# EAGLE board MGBC-MBL-01_1-5_2 (EAGLE 9.6.2)
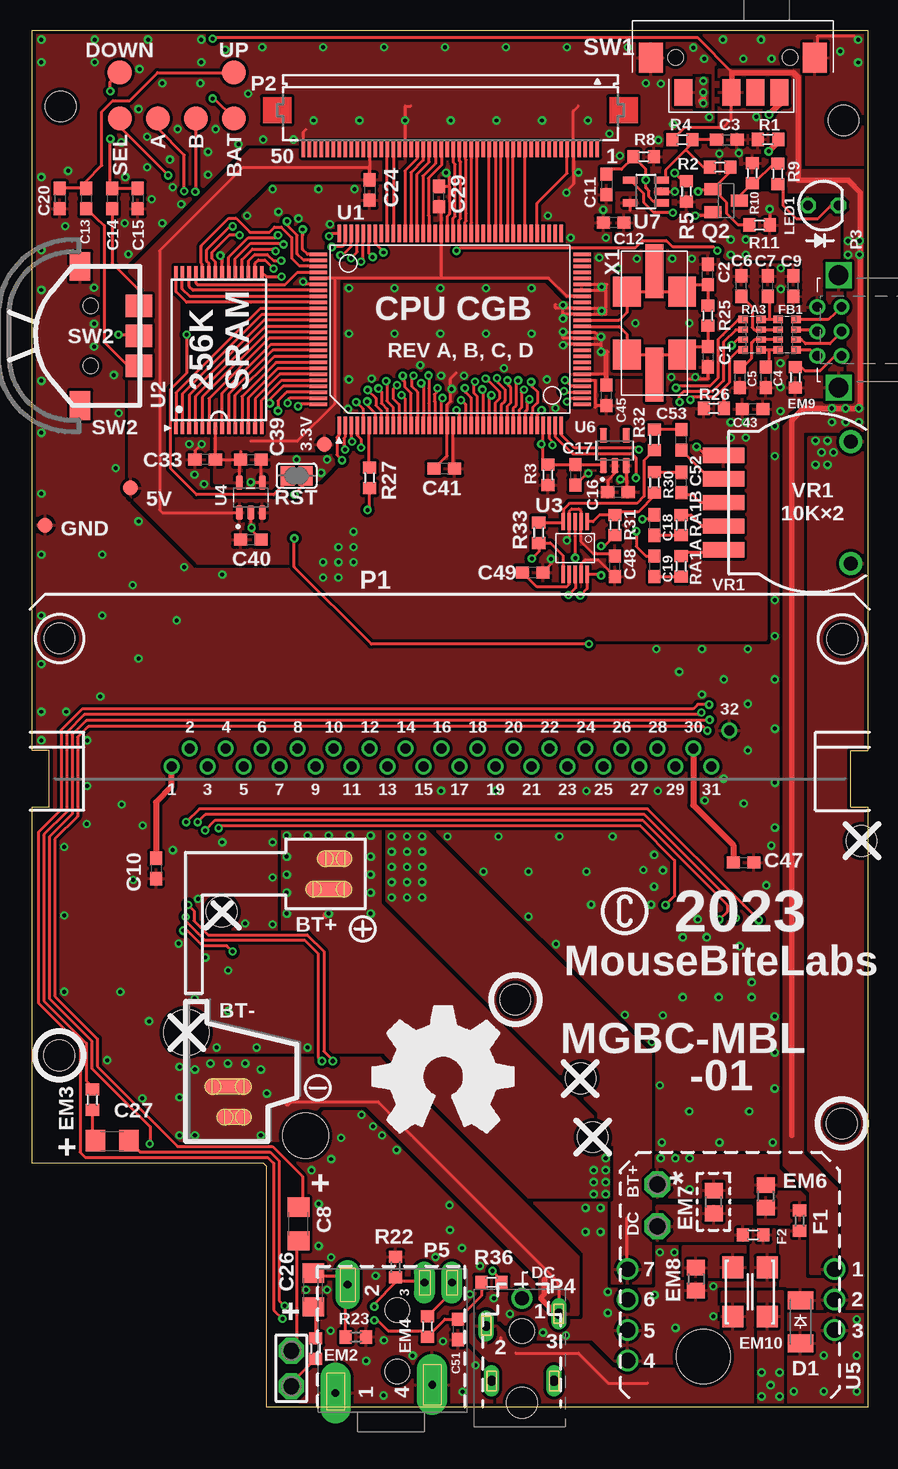
[diagram p1: board, top side]
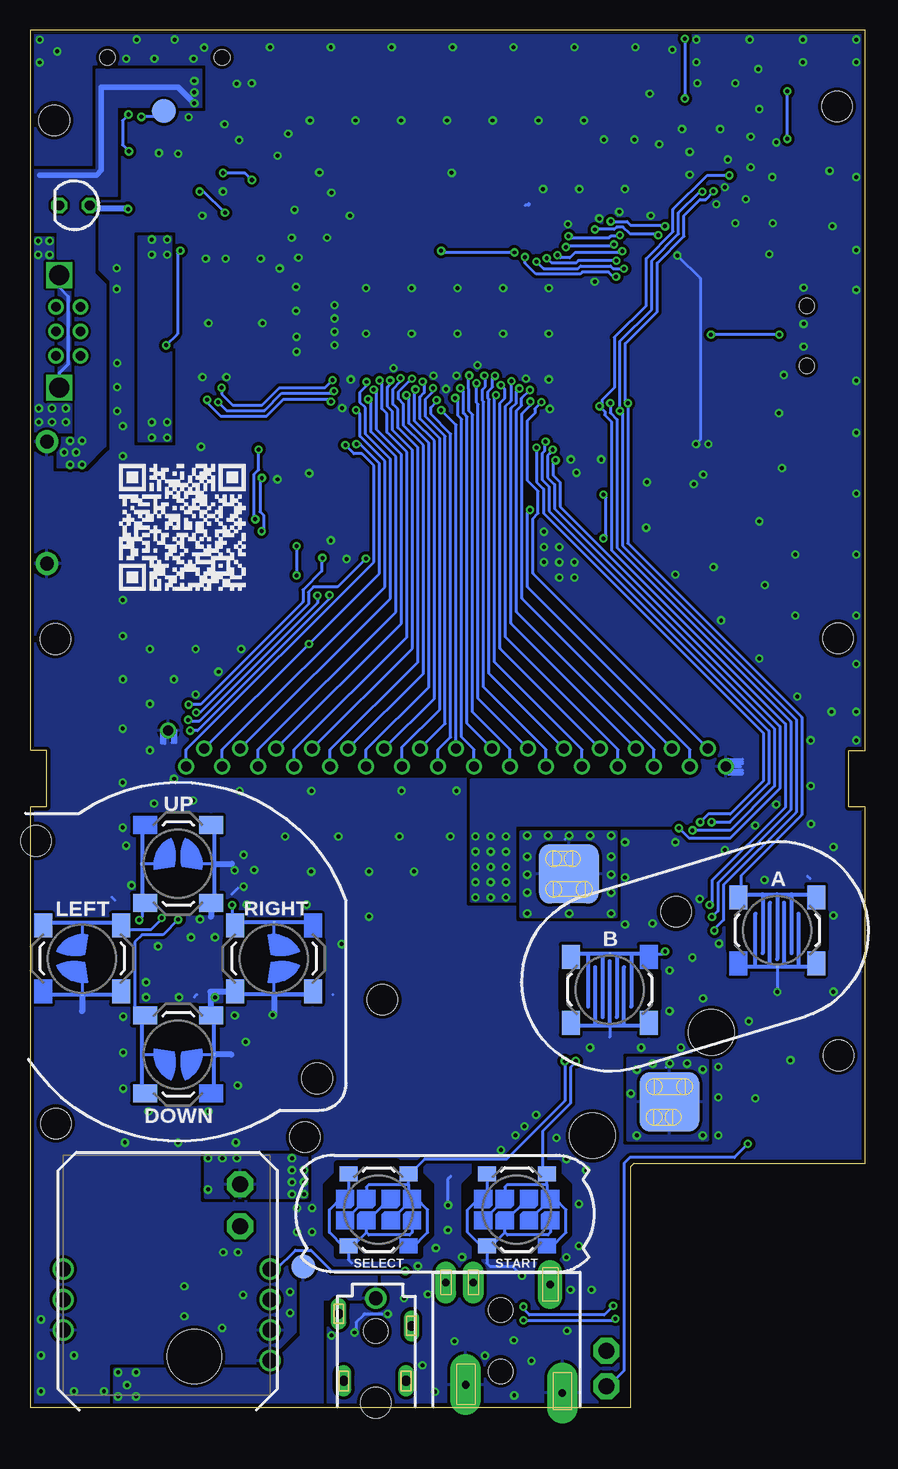
[diagram p2: board, bottom side, seen from below]

Size 69.66 x 114.8 mm. Coordinates in mm from the lower left corner, seen from the top.
Outline: 0,54.73 0,114.8 69.66,114.8 69.66,54.73 68.25,54.73 68.25,50.03 69.66,50.03 69.66,0 19.56,0 19.56,20.06 19.3,20.31 0,20.31 0,50.03 1.4,50.03 1.4,54.73 0,54.73
Copper layers (1*16): Top 0.0356mm / dielectric 1.5011mm / Bottom 0.0356mm
Design rules "jlcpcb *": minimum track width 10mil, minimum drill 13mil, track to track 8mil, track to pad 8mil, pad to pad 8mil, via to via 8mil, smd to smd 5mil, copper to edge 12mil, drill to drill 22mil, minimum pad ring 10mil, minimum via ring 7mil, stop-mask expansion 2.5mil, vias tented up to drill 14mil, thermal gap 10mil
Holes 2.54 mm at 2.37,108.43 67.63,107.27 2.28,64.08 67.54,64.03 2.25,29.33 67.5,23.64 40.28,33.97 45.72,27.4 46.74,22.5 15.8,41.29 69.15,47.19
Holes 3.81 mm at 12.85,31.23 22.78,22.63
Holes 4.5 mm at 55.95,4.22
tRestrict: area 64.1,99.6 to 65.2,100.4; area 24.6,-0.8 to 27.7,-0.1; area 58.9,102.1 to 59.5,103.1; area 45.5,88.8 to 46.2,91.6; area 22.5,14.3 to 23,16.2; area 23.8,-1.8 to 35.8,0
bRestrict: area 24.6,-0.8 to 27.7,-0.1; area 32.8,52.9 to 56.3,53.8; area 23.8,-1.8 to 35.8,0; area 3.7,42.8 to 4.1,43.2; area 17.5,31.2 to 18.3,32.2; area 45.5,33.8 to 46.4,34.9; area 53.7,48.3 to 54.8,49.2; area 45.4,33.8 to 45.6,35.8

## Footprints (pad centres in the part's own frame; a part is rotated, then mirrored left to right if it is on the bottom)
B1,27 = smd 1.27 x 1.27: TP 0,0
MGB+BATTERY4 = smd 4.953 x 4.953 bottom: P$1 0.5,0 | smd 2.959 x 1.397: P$2 0.997,1.27 | smd 3.937 x 1.397: P$3 0.514,-1.27
MGB-BATTERY4 = smd 4.953 x 4.953 bottom: P$1 0.25,0.117 | smd 2.959 x 1.397: P$3 0.743,-1.143 | smd 3.937 x 1.397: P$4 0.26,1.397
DMG_BTN3 = smd 1.5 x 2: P$1 -3.25,2.75; P$3 3.25,2.75; P$4 3.25,-2.75 | smd 0.25 x 0.25: P$2 0,-3
TP20R = smd 2 x 2: TP 0,0
P1-13 = drill 1.321 pad 2.159 octagon: TP 0,0
C0603 = smd 1.1 x 1: 1 -0.85,0; 2 0.85,0
C1206 = smd 1.6 x 1.8: 1 -1.4,0; 2 1.4,0
SOD-123_MINI-SMA = smd 1.5 x 2.1: A 1.8,0; C -1.8,0
MGB_BTN1_2 = smd 1.5 x 2: P$1 -3.25,2.75; P$3 3.25,2.75; P$4 3.25,-2.75 | smd 0.25 x 0.25: P$2 0,-3
R0603 = smd 1 x 1.1: 1 -0.85,0; 2 0.85,0
R0805 = smd 1.3 x 1.5: 1 -0.95,0; 2 0.95,0
ACM4532 = smd 1.8 x 1.75: 1 -2.05,1.425; 2 -2.05,-1.425; 3 2.05,-1.425; 4 2.05,1.425
EXB38V = smd 0.6 x 0.8: 1 -1.275,-0.75; 4 1.275,-0.75; 5 1.275,0.75; 8 -1.275,0.75 | smd 0.5 x 0.8: 2 -0.4,-0.75; 3 0.4,-0.75; 6 0.4,0.75; 7 -0.4,0.75
LED3MM = drill 0.813 octagon: A -1.27,0; K 1.27,0
MGB-CART = drill 0.83: 1 0,0; 2 1.5,1.5; 3 3,0; 4 4.5,1.5; 5 6,0; 6 7.5,1.5; 7 9,0; 8 10.5,1.5; 9 12,0; 10 13.5,1.5; 11 15,0; 12 16.5,1.5; 13 18,0; 14 19.5,1.5; 15 21,0; 16 22.5,1.5; 17 24,0; 18 25.5,1.5; 19 27,0; 20 28.5,1.5; 21 30,0; 22 31.5,1.5; 23 33,0; 24 34.5,1.5; 25 36,0; 26 37.5,1.5; 27 39,0; 28 40.5,1.5; 29 42,0; 30 43.5,1.5; 31 45,0; 32 46.5,3
FH12-50S-0.5SH = smd 0.3 x 1.3: 1 -12.25,3.25; 2 -11.75,3.25; 3 -11.25,3.25; 4 -10.75,3.25; 5 -10.25,3.25; 6 -9.75,3.25; 7 -9.25,3.25; 8 -8.75,3.25; 9 -8.25,3.25; 10 -7.75,3.25; 11 -7.25,3.25; 12 -6.75,3.25; 13 -6.25,3.25; 14 -5.75,3.25; 15 -5.25,3.25; 16 -4.75,3.25; 17 -4.25,3.25; 18 -3.75,3.25; 19 -3.25,3.25; 20 -2.75,3.25; 21 -2.25,3.25; 22 -1.75,3.25; 23 -1.25,3.25; 24 -0.75,3.25; 25 -0.25,3.25; 26 0.25,3.25; 27 0.75,3.25; 28 1.25,3.25; 29 1.75,3.25; 30 2.25,3.25; 31 2.75,3.25; 32 3.25,3.25; 33 3.75,3.25; 34 4.25,3.25; 35 4.75,3.25; 36 5.25,3.25; 37 5.75,3.25; 38 6.25,3.25; 39 6.75,3.25; 40 7.25,3.25; 41 7.75,3.25; 42 8.25,3.25; 43 8.75,3.25; 44 9.25,3.25; 45 9.75,3.25; 46 10.25,3.25; 47 10.75,3.25; 48 11.25,3.25; 49 11.75,3.25; 50 12.25,3.25
CGB-LINK = drill 0.8: +5V 1.909,2.032; CLK -2.159,2.032; GND -2.159,0; IN -0.125,2.032; OUT 1.909,0; SD -0.125,0 | drill 1.651 pad 1.905 square: P$7 -4.822,0.254; P$10 4.572,0.254
MGB-PWRJACK = drill 1.143 pad 1.778: 1 -3.629,-2.005 | drill 0.8 pad 1.3 long: 2 -6.604,-4.314; 3 -0.539,-3.302; 4 -6.15,-8.89; 5 -0.953,-8.89 | hole 2.54: -3.619,-10.722 | hole 2.032: -3.619,-4.753
MGB-HEADPHONE = drill 0.635 pad 2.54 long: GND -4.644,-4.246; SWGND 3.425,-3.556 | drill 0.635 pad 2.032 long: L -3.623,4.779 | drill 0.635 pad 1.75 long: R 2.79,4.949; SW 5.08,4.949 | hole 2.032: 0.508,2.676; 0.508,-2.442
SOT23-BEC = smd 1 x 1.4: B -0.95,-1.1; C 0,1.1; E 0.95,-1.1
SJ = smd 1.168 x 1.6: 1 -0.762,0; 2 0.762,0
DMG_BTN1_W2 = smd 1.25 x 1.5: P$1 -3,2.5; P$3 3,2.5; P$4 3,-2.5 | smd 0.05 x 0.05: P$2 0,-4.07
MGB-SWITCH = smd 1.5 x 2.2: P$1 -3.75,-2.141; P$2 2.25,-2.141; P$3 4.25,-2.141; P$C 0.25,-2.141 | smd 2 x 2.5: P$MP1 -6.48,0.759; P$MP2 7.22,0.759 | hole 1.3: -4.4,0.759; 5.15,0.759
NAV_SWITCH = smd 1.9 x 2.2: 1 -2.5,-4; 2 2.5,-4; T 0,-4 | smd 2.4 x 1.7: C 5.8,0.9; NC -5.8,0.9 | hole 1.25: -2.5,0; 2.5,0
QFP-128 = smd 0.3 x 1.45: 1 -8.25,-4.5; 2 -7.75,-4.5; 3 -7.25,-4.5; 4 -6.75,-4.5; 5 -6.25,-4.5; 6 -5.75,-4.5; 7 -5.25,-4.5; 8 -4.75,-4.5; 9 -4.25,-4.5; 10 -3.75,-4.5; 11 -3.25,-4.5; 12 -2.75,-4.5; 13 -2.25,-4.5; 14 -1.75,-4.5; 15 -1.25,-4.5; 16 -0.75,-4.5; 17 -0.25,-4.5; 18 0.25,-4.5; 19 0.75,-4.5; 20 1.25,-4.5; 21 1.75,-4.5; 22 2.25,-4.5; 23 2.75,-4.5; 24 3.25,-4.5; 25 3.75,-4.5; 26 4.25,-4.5; 27 4.75,-4.5; 28 5.25,-4.5; 29 5.75,-4.5; 30 6.25,-4.5; 31 6.75,-4.5; 32 7.25,-4.5; 33 7.75,-4.5; 34 8.25,-4.5; 35 8.75,-4.5; 36 9.25,-4.5; 37 9.75,-4.5; 38 10.25,-4.5; 65 10.25,11.5; 66 9.75,11.5; 67 9.25,11.5; 68 8.75,11.5; 69 8.25,11.5; 70 7.75,11.5; 71 7.25,11.5; 72 6.75,11.5; 73 6.25,11.5; 74 5.75,11.5; 75 5.25,11.5; 76 4.75,11.5; 77 4.25,11.5; 78 3.75,11.5; 79 3.25,11.5; 80 2.75,11.5; 81 2.25,11.5; 82 1.75,11.5; 83 1.25,11.5; 84 0.75,11.5; 85 0.25,11.5; 86 -0.25,11.5; 87 -0.75,11.5; 88 -1.25,11.5; 89 -1.75,11.5; 90 -2.25,11.5; 91 -2.75,11.5; 92 -3.25,11.5; 93 -3.75,11.5; 94 -4.25,11.5; 95 -4.75,11.5; 96 -5.25,11.5; 97 -5.75,11.5; 98 -6.25,11.5; 99 -6.75,11.5; 100 -7.25,11.5; 101 -7.75,11.5; 102 -8.25,11.5 | smd 1.45 x 0.3: 39 12,-2.75; 40 12,-2.25; 41 12,-1.75; 42 12,-1.25; 43 12,-0.75; 44 12,-0.25; 45 12,0.25; 46 12,0.75; 47 12,1.25; 48 12,1.75; 49 12,2.25; 50 12,2.75; 51 12,3.25; 52 12,3.75; 53 12,4.25; 54 12,4.75; 55 12,5.25; 56 12,5.75; 57 12,6.25; 58 12,6.75; 59 12,7.25; 60 12,7.75; 61 12,8.25; 62 12,8.75; 63 12,9.25; 64 12,9.75; 103 -10,9.75; 104 -10,9.25; 105 -10,8.75; 106 -10,8.25; 107 -10,7.75; 108 -10,7.25; 109 -10,6.75; 110 -10,6.25; 111 -10,5.75; 112 -10,5.25; 113 -10,4.75; 114 -10,4.25; 115 -10,3.75; 116 -10,3.25; 117 -10,2.75; 118 -10,2.25; 119 -10,1.75; 120 -10,1.25; 121 -10,0.75; 122 -10,0.25; 123 -10,-0.25; 124 -10,-0.75; 125 -10,-1.25; 126 -10,-1.75; 127 -10,-2.25; 128 -10,-2.75
TSOP1-28 = smd 1 x 0.3: 1 -6.5,3.575; 2 -6.5,3.025; 3 -6.5,2.475; 4 -6.5,1.925; 5 -6.5,1.375; 6 -6.5,0.825; 7 -6.5,0.275; 8 -6.5,-0.275; 9 -6.5,-0.825; 10 -6.5,-1.375; 11 -6.5,-1.925; 12 -6.5,-2.475; 13 -6.5,-3.025; 14 -6.5,-3.575; 15 6.5,-3.575; 16 6.5,-3.025; 17 6.5,-2.475; 18 6.5,-1.925; 19 6.5,-1.375; 20 6.5,-0.825; 21 6.5,-0.275; 22 6.5,0.275; 23 6.5,0.825; 24 6.5,1.375; 25 6.5,1.925; 26 6.5,2.475; 27 6.5,3.025; 28 6.5,3.575
VSSOP10 = smd 1.45 x 0.3: 1 -2.2,0.985; 2 -2.2,0.485; 3 -2.2,-0.015; 4 -2.2,-0.515; 5 -2.2,-1.015; 6 2.2,-1.015; 7 2.2,-0.515; 8 2.2,-0.015; 9 2.2,0.485; 10 2.2,0.985
SOT95P280X145-5N = smd 1.21 x 0.59: 1 -1.255,0.95; 2 -1.255,0; 3 -1.255,-0.95; 4 1.255,-0.95; 5 1.255,0.95
MGB-PWRBD = drill 1.27: 1 -0.25,10.5; 2 -0.25,7.96; 3 -0.25,5.42; 4 17,2.88; 5 17,5.42; 6 17,7.96; 7 17,10.5
SOT-23-5 = smd 1.21 x 0.59: 1 -1.255,0.95; 2 -1.255,0; 3 -1.255,-0.95; 4 1.255,-0.95; 5 1.255,0.95
DBV-R-PDSO-G5 = smd 0.6 x 1.2: 1 -0.95,-1.306; 2 0,-1.306; 3 0.95,-1.306; 4 0.95,1.306; 5 -0.95,1.306
MGB-POT = smd 1.27 x 3.429: P$1 -3.937,-5.524; P$2 -1.968,-5.524; P$3 0,-5.524; P$4 1.968,-5.524; P$5 3.937,-5.524 | drill 1.143 pad 1.905: P$6 -5.08,5.08; P$7 5.08,5.08
7.5X5-4-PAD = smd 2.3 x 2.5: 1 2.3,-2.625; 2 2.3,2.625; 3 -2.3,2.625; 4 -2.3,-2.625 | smd 1.5 x 4.5: 5 0,-4.275; 6 0,4.325

## Placement (x,y rotation side)
3.3V  PTR1B1,27  [B1,27]  24.36,80.26 0 top
5V  PTR1B1,27  [B1,27]  8.19,76.62 0 top
+  MGB+BATTERY4  [MGB+BATTERY4]  24.22,44.46 0 top
-  MGB-BATTERY4  [MGB-BATTERY4]  16.09,25.33 0 top
A  DMG-BTN  [DMG_BTN3]  7.37,39.74 0 bottom
B  DMG-BTN  [DMG_BTN3]  21.32,34.79 180 bottom
BATT  PTR1TP20R  [TP20R]  16.83,107.43 0 top
BRIGHTNESS  PTR1TP20R  [TP20R]  16.8,111.24 0 top
BT+  TPPAD1-13  [P1-13]  52.13,18.57 0 top
C1  18pF  [C0603]  56.32,87.56 270 top
C2  27pF  [C0603]  56.32,94.42 90 top
C3  100n  [C0603]  57.91,105.66 0 top
C4  22pF  [C0603]  61.16,85.84 270 top
C5  100pF  [C0603]  59,85.84 270 top
C6  100pF  [C0603]  59.12,93.44 90 top
C7  100pF  [C0603]  61.33,93.44 90 top
C8  [C1206]  22.2,15.27 90 top
C9  0.01uF  [C0603]  63.47,93.44 90 top
C10  0.01uF  [C0603]  10.31,44.9 270 top
C11  1u  [C0603]  47.88,101.93 270 top
C12  100n  [C0603]  48.47,98.76 180 top
C13  100pF  [C0603]  4.48,100.75 270 top
C14  100pF  [C0603]  6.65,100.75 270 top
C15  27pF  [C0603]  8.81,100.75 270 top
C16  1uF  [C0603]  48.83,76.29 0 top
C17  1uF  [C0603]  45.28,77.72 270 top
C18  1uF  [C0603]  51.88,73.53 270 top
C19  1uF  [C0603]  51.88,70.1 270 top
C20  27pF  [C0603]  2.31,100.75 270 top
C24  0.1uF  [C0603]  28.13,101.46 270 top
C26  100uF  [C1206]  23.43,9.77 90 top
C27  100uF  [C1206]  6.67,22.2 0 top
C29  0.01uF  [C0603]  33.89,100.91 90 top
C33  0.01uF  [C0603]  14.41,78.99 180 top
C39  1uF  [C0603]  18.22,78.99 0 top
C40  1uF  [C0603]  18.22,72.32 0 top
C41  0.01uF  [C0603]  34.35,78.22 180 top
C43  0.1uF  [C0603]  60.06,83.21 0 top
C45  0.01uF  [C0603]  47.89,84.34 90 top
C47  150pF  [C0603]  59.3,45.4 0 top
C48  1uF  [C0603]  48.58,70.1 90 top
C49  1uF  [C0603]  41.72,69.59 0 top
C51  1uF  [C0603]  35.5,6.48 270 top
C52  100nF  [C0603]  54.1,77.08 90 top
C53  100nF  [C0603]  54.1,80.64 90 top
D1  CGRM4001-G  [SOD-123_MINI-SMA]  64.06,7.12 270 top
DC  TPPAD1-13  [P1-13]  52.13,15.07 0 top
DC_IN  TPTP20R  [TP20R]  46.88,11.72 0 bottom
DOWN  DMG-BTN  [MGB_BTN1_2]  57.31,29.4 90 bottom
EM2  BLM18BD102SN1D  [R0603]  23.63,4.88 90 top
EM3  BLM18BD102SN1D  [R0603]  5.01,25.62 270 top
EM4  BLM18BD102SN1D  [R0603]  32.96,6.73 90 top
EM6  BLM21P221SG  [R0805]  61.14,17.57 270 top
EM7  BLM21P221SG  [R0805]  56.82,17.11 90 top
EM8  BLM21P221SG  [R0805]  55.34,10.67 270 top
EM9  BLM21P221SG  [R0603]  63.63,85.84 270 top
EM10  [ACM4532]  59.85,9.6 270 top
F1  1A  [R0603]  63.98,15.54 270 top
F2  1A  [R0603]  60.12,14.35 180 top
FB1  4W601  [EXB38V]  62.93,89.4 90 top
GND  PTR1B1,27  [B1,27]  1.08,73.53 0 top
LED1  [LED3MM]  65.95,100.17 0 top
LEFT  DMG-BTN  [MGB_BTN1_2]  65.31,37.4 0 bottom
OSD_A  PTR1TP20R  [TP20R]  10.48,107.43 0 top
OSD_B  PTR1TP20R  [TP20R]  13.65,107.43 0 top
OSD_SEL  PTR1TP20R  [TP20R]  7.3,107.43 0 top
P1  MGB-CART  [MGB-CART]  11.62,53.4 0 top
P2  GBC_LCDH  [FH12-50S-0.5SH]  34.86,108.11 180 top
P3  LINKPORTDMG-LINK-SHORT  [CGB-LINK]  67.49,89.8 90 top
P4  MGB-PWRJACK  [MGB-PWRJACK]  44.45,11.08 0 top
P5  MGBHPMGB  [MGB-HEADPHONE]  29.91,5.42 0 top
PALETTE  PTR1TP20R  [TP20R]  7.29,111.24 0 top
Q2  3904  [SOT23-BEC]  57.85,100.58 270 top
R1  1k  [R0603]  61.34,105.68 180 top
R2  1.5M  [R0603]  57.34,103.37 180 top
R3  18k  [R0603]  42.99,77.72 90 top
R4  200k  [R0603]  54.21,105.66 180 top
R5  140k  [R0603]  54.55,101.34 270 top
R8  100k  [R0603]  50.99,104.23 180 top
R9  18k  [R0603]  62.16,102.82 90 top
R10  100k  [R0603]  60.03,102.86 90 top
R11  18k  [R0603]  60.64,98.54 180 top
R22  1k  [R0603]  30.29,11.68 90 top
R23  1k  [R0603]  26.99,5.84 0 top
R25  1.5M  [R0603]  56.32,90.99 90 top
R26  5.6k  [R0603]  56.83,83.26 180 top
R27  100  [R0603]  28.13,77.46 270 top
R30  47k  [R0603]  51.88,77.08 90 top
R31  18k  [R0603]  48.58,73.53 90 top
R32  47k  [R0603]  51.88,80.64 90 top
R33  18k  [R0603]  42.23,72.89 90 top
R36  100k  [R0603]  38.29,10.41 0 top
RA1A  510  [R0603]  54.1,70.1 270 top
RA1B  510  [R0603]  54.1,73.53 270 top
RA3  4W601  [EXB38V]  60.01,89.4 90 top
RIGHT  DMG-BTN  [MGB_BTN1_2]  49.31,37.4 180 bottom
RST  [SJ]  22.03,77.64 180 top
SELECT  DMG-BTN  [DMG_BTN1_W2]  40.6,16.46 90 bottom
SPK+  PTR1PAD1-13  [P1-13]  21.6,4.69 0 top
SPK-  PTR1PAD1-13  [P1-13]  21.6,1.75 0 top
START  DMG-BTN  [DMG_BTN1_W2]  29.07,16.46 90 bottom
SW  TPTP20R  [TP20R]  58.51,108.05 0 bottom
SW1  MGB-SW1  [MGB-SWITCH]  58.04,111.75 0 top
SW2  NAV_SWITCH  [NAV_SWITCH]  4.88,89.3 90 top
U1  GBC_CPU  [QFP-128]  33.85,86.35 0 top
U2  LH52256CVTXIZ  [TSOP1-28]  15.56,88.13 90 top
U3  LM4853  [VSSOP10]  45.28,71.62 270 top
U4  TLV70233QDBVRQ1  [SOT95P280X145-5N]  18.22,75.81 90 top
U5  MGB-PWR_BD  [MGB-PWRBD]  66.64,1 0 bottom
U6  TPS3840  [SOT-23-5]  48.58,79.75 90 top
U7  TL331  [DBV-R-PDSO-G5]  51.17,101.34 90 top
UP  DMG-BTN  [MGB_BTN1_2]  57.31,45.3 270 bottom
VR1  [MGB-POT]  63.17,75.41 270 top
X1  8.388608MHZ12SMX-B-4-PAD  [7.5X5-4-PAD]  51.88,90.35 0 top

## Tracks (layer width: path | path; a pad name or v marks a point on that pad's centre or on a via)
!CS1
  Top 0.254: U1.110 23.83,92.58 22.98,92.58 13.16,92.58 12.52,93.22 12.52,94.61 U2.27
!MRD
  Top 0.254: U1.112 23.83,91.58 19,91.58 11.98,84.57 U2.1
!MWR
  Top 0.254: U1.117 19.75,89.1 14.73,84.08 U2.6
+3V3
  Top 0.254: U2.7 15.26,81.51 C33.1 17.17,78.99 17.27,78.89 | 34.1,94.13 U1.85 34.1,99.85 C29.1 | 25.21,94.1 34.1,94.1 34.1,94.13 | 25.21,94.1 U1.107 | U1.57 44.58,92.6 43.05,94.13 34.1,94.13 | U4.5 17.27,78.89 | 17.27,78.89 C39.1 17.37,79.66 | 18.22,80.51 22.1,80.51 25.21,83.62 25.21,94.1
  pour Top: 33.46,100.83 33.46,97.66 24.57,97.66 24.57,85.59 15.18,85.59 15.18,77.08 17.46,77.08 17.46,79.75 25.59,79.75 25.59,94.1 42.99,94.1 44.51,92.58 46.42,92.58 46.42,92.96 45.28,92.96 45.28,96.64 36.89,96.64 36,97.53 36,100.83
+5V  (via drill 0.33)
  Top 0.254: C48.1 47.22,70.6 46.1,70.6 45.76,70.26 U3.9 | U6.2 48.58,77.84 47.98,77.25 C16.1 | C45.1 47.07,83.49 46.92,83.34 46.92,85.6 U1.43 | C41.1 35.1,78.33 U1.20 | P2.39 28.11,102.33 C24.1 28.13,103.29 28.11,103.31 17.53,103.31 10.6,96.39 10.6,74.8 10.84,74.56 U4.1 | 49.86,99.78 U7.5 | 39.14,10.37 R36.2 39.14,10.58 v38.37,11.35 | 49.55,11.58 U5.7 49.56,11.58 49.56,15.75 | v61.48,99.88 61.49,99.87 R11.1
  Top 0.508: C10.1 10.31,50.41 11.62,51.72 P1.1
  Bottom 0.254: 11.62,53.46 P1.1 10.41,53.4 | v38.37,11.35 38.38,11.36 44.51,11.36 46.23,13.09 47.53,13.09 49.13,11.5 U5.7 | 11.47,53.65 10.26,53.65 | 11.47,53.8 10.26,53.8 | 11.47,54 10.26,54 | 11.47,53.1 10.26,53.1 | 11.47,52.9 10.26,52.9 | 11.47,52.8 10.26,52.8
  Bottom 0.508: LED1.A 64.45,99.94 61.55,99.94 v61.48,99.88
  other vias: 29.97,42.49 31.24,42.49 32.51,42.49 32.51,43.76 31.24,43.76 29.97,43.76 29.97,45.03 31.24,45.03 32.51,45.03 29.97,46.3 29.97,47.57 31.24,47.57 32.51,47.57 32.51,46.3 31.24,46.3 26.8,72.97 26.8,71.7 26.8,70.43 25.53,69.16 25.53,70.43 25.53,71.7 24.26,70.43 24.26,69.16 58.23,80.83 59.5,82.1 58.23,82.1 59.5,80.83 58.23,97.34 59.5,97.34 59.5,96.07 58.23,96.07
  pour Bottom (isolate 0.254): 8.38,53.33 11.87,53.33 11.87,54.09 27.75,69.97 27.75,76.06 8.38,56.7
  pour Top (isolate 0.254, rank 5): 48.32,10.36 51.56,10.36 51.56,29.39 32.83,48.12 29.52,48.12 29.52,41.48 48.32,22.68
  pour Bottom (isolate 0.254): 8.7,55.74 8.7,51.94 12.15,48.49 29.25,48.49 29.25,42.15 32.83,42.15 32.83,52.33 14.65,52.33 13.78,53.2 13.78,53.84 11.87,55.74
  pour Top (isolate 0.254, rank 3): 15.68,79.24 15.68,70.35 22.03,70.35 28.38,64 61.2,64 61.2,82.42 59.66,82.42 59.66,84 53.29,84 51.7,85.59 44.89,85.59 44.89,82.42 44.26,81.78 25.84,81.78 25.84,79.24
  pour Top (isolate 0.254): 29.65,104.78 18.12,104.78 8.06,94.72 8.06,76.06 13.78,70.35 17.59,70.35 17.59,76.06 13.78,76.06 12.24,77.61 12.24,93.17 13.78,94.72 13.78,97.02 16.32,99.56 16.95,99.56 19.73,102.34 29.65,102.34
  pour Top (isolate 0.254, rank 3): 48.7,101.22 48.7,97.02 49.1,96.62 56.96,96.62 57.83,95.75 64.58,95.75 64.9,95.43 67.49,95.43 67.49,101.22
  pour Top (isolate 0.254): 65.81,95.75 65.81,91.38 63.38,91.38 63.38,92.58 64.32,92.58 64.32,95.75
  pour Bottom (isolate 0.254): 60.57,80.51 60.57,97.58 57.91,97.58 57.91,80.51
A0  (via drill 0.33)
  Top 0.254: U1.9 29.6,83.21 29.12,83.69 29.12,84.66 v28.86,84.92
  Bottom 0.254: P1.6 29.55,65.32 29.55,83.26 29.12,83.69 29.12,84.66 v28.86,84.92
A1  (via drill 0.33)
  Top 0.254: U1.10 30.1,83.36 29.57,83.88 29.57,85.46 v29.51,85.53
  Bottom 0.254: P1.7 20.62,54.81 30.01,64.19 30.01,83.45 29.57,83.88 29.57,85.46 v29.51,85.53
A2  (via drill 0.33)
  Top 0.254: v30.41,85.19 30.09,84.88 30.09,84.08 30.6,83.58 U1.11
  Bottom 0.254: P1.8 30.46,63.24 30.46,83.71 30.09,84.08 30.09,84.88 v30.41,85.19
A3  (via drill 0.33)
  Top 0.254: v30.8,84.37 31.1,84.07 U1.12
  Bottom 0.254: P1.9 23.62,54.81 30.92,62.11 30.92,84.24 v30.8,84.37
A4  (via drill 0.33)
  Top 0.254: v30.89,85.97 30.89,85.66 31.08,85.47 31.08,85.04 31.6,84.52 U1.13
  Bottom 0.254: P1.10 31.38,61.15 31.38,83.99 31.47,84.09 31.47,84.64 31.08,85.04 31.08,85.79 v30.9,85.97 v30.89,85.97
A5  (via drill 0.33)
  Top 0.254: U1.14 32.12,81.87 32.12,84.65 31.68,85.08 31.68,85.89 v31.78,85.99
  Bottom 0.254: P1.11 26.62,54.81 31.83,60.02 31.83,83.81 31.93,83.9 31.93,84.83 31.68,85.08 31.68,85.89 v31.78,85.99
A6  (via drill 0.33)
  Top 0.254: v32.43,85.35 32.62,85.17 32.62,81.87 U1.15
  Bottom 0.254: P1.12 32.29,59.07 32.29,83.6 32.43,83.75 v32.43,85.35
A7  (via drill 0.33)
  Top 0.254: 33.1,84.9 33.11,84.91 33.11,84.95 | 33.11,84.95 33.11,85.93 v33.04,86 | U1.16 33.1,83.65 33.08,83.66 33.08,84.93 33.11,84.95
  Bottom 0.254: P1.13 29.62,54.81 32.75,57.94 32.75,82.73 33.06,83.05 33.06,84.87 33.11,84.91 33.11,85.93 v33.04,86
A8  (via drill 0.33)
  Top 0.254: 33.62,81.87 U1.17 33.6,83.79 33.54,83.85 33.54,84.41 33.78,84.65 v33.78,84.95 33.6,84.77
  Bottom 0.254: P1.14 33.21,56.98 33.21,82.55 33.52,82.86 33.52,84.69 v33.78,84.95
A9  (via drill 0.33)
  Top 0.254: 34.12,81.87 U1.18 34.1,84.01 v34.21,84.13
  Bottom 0.254: P1.15 32.62,54.81 33.66,55.85 33.66,82.36 33.98,82.67 33.98,83.89 v34.21,84.13
A10  (via drill 0.33)
  Top 0.254: v35.37,83.12 35.6,82.9 U1.21
  Bottom 0.254: P1.16 34.12,81.87 v35.37,83.12
A11  (via drill 0.33)
  Top 0.254: U1.22 36.1,82.83 36.11,82.84 36.11,83.59 v35.75,83.95
  Bottom 0.254: P1.17 35.62,54.81 34.58,55.85 34.58,81.12 36.23,82.78 36.23,83.34 35.75,83.82 v35.75,83.95
A12  (via drill 0.33)
  Top 0.254: v36.07,84.95 36.07,84.65 36.58,84.14 36.58,81.87 U1.23
  Bottom 0.254: P1.18 35.03,56.98 35.03,80.94 36.69,82.59 36.69,84.01 36.07,84.64 v36.07,84.95
A13  (via drill 0.33)
  Top 0.254: v36.92,85.49 36.79,85.36 36.79,84.57 37.08,84.28 37.08,81.87 U1.24
  Bottom 0.254: P1.19 38.62,55.03 35.49,58.16 35.49,80.75 37.15,82.4 37.15,84.2 36.79,84.56 36.79,85.36 v36.92,85.49
A14  (via drill 0.33)
  Top 0.254: v37.53,84.84 37.6,84.77 U1.25
  Bottom 0.254: P1.20 35.95,59.07 35.95,80.56 37.6,82.21 37.6,84.76 v37.53,84.84
A15  (via drill 0.33)
  Top 0.254: v38.28,84.35 38.1,84.17 U1.26
  Bottom 0.254: P1.21 41.62,54.81 36.41,60.02 36.41,80.37 38.06,82.02 38.06,84.13 v38.28,84.35
BATT  (via drill 0.35)
  Top 0.504: 24.47,41.04 24.51,41 24.46,40.95 | 28.07,44.46 28.11,44.5 | 24.77,47.59 v24.71,47.65 | 21.25,44.46 21.21,44.5
  Bottom 0.254: 25.02,47.34 v24.71,47.65
  other vias: 47.81,20.75 47.81,19.75 47.81,18.75 47.81,17.75 46.81,17.75 46.81,18.75 46.81,19.75 54.81,20.75 54.81,18.15 52.4,20.75 53.62,20.75 21.21,47.65 28.21,47.65 28.21,44.4 21.21,44.4 21.21,41.15 28.21,41.15 24.71,41.15 21.21,45.9 28.21,45.9 22.96,47.65 26.46,47.65 21.21,42.9 28.21,42.9
  pour Top (isolate 0.254, rank 4): 20.83,48.12 20.83,39.37 23.3,39.37 23.94,38.73 23.94,29.07 27.75,29.07 39.31,17.51 48.07,17.51 48.07,22.91 29.02,41.95 29.02,48.12
  pour Bottom (isolate 0.25, rank 5): 55.06,21 55.06,17.5 46.56,17.5 46.56,21
  pour Top (isolate 0.25, rank 5): 52.06,21 62.56,21 64.56,19 64.56,17.5 52.06,17.5
  pour Bottom: 20.81,48 20.81,40.85 28.71,40.85 28.71,48
CK1
  Top 0.254: U1.52 45.87,90.08 48.95,90.08 49.59,89.44 X1.4 51.81,87.73 | 51.81,87.73 X1.1 53.88,87.74 54.55,88.41 C1.1 R25.1 | X1.5 51.81,86.15 51.81,87.73
CK2
  Top 0.254: U1.53 45.87,90.62 48.95,90.62 49.56,91.24 49.58,91.24 X1.3 51.81,92.98 | 51.81,92.98 X1.2 53.96,92.98 54.55,93.57 C2.1 R25.2 | X1.6 51.88,93.05 51.81,92.98
CLK  (via drill 0.33)
  Top 0.254: U1.5 27.6,82.82 27.57,82.84 27.57,83.23 v27.02,83.78
  Bottom 0.254: P1.2 27.72,69.5 27.72,74.08 27.29,74.52 27.29,76.34 28.18,77.23 28.18,82.24 27.57,82.84 27.57,83.23 v27.02,83.78
CS  (via drill 0.33)
  Top 0.254: v27.97,84.79 28.66,84.1 28.66,83.5 29.1,83.07 U1.8
  Bottom 0.254: P1.5 17.62,54.81 29.09,66.28 29.09,83.07 28.66,83.5 28.66,84.1 v27.97,84.79
D0  (via drill 0.33)
  Top 0.254: v37.81,85.73 38.02,85.51 38.07,85.51 38.95,84.64 38.95,84.07 38.6,83.71 U1.27
  Bottom 0.254: P1.22 36.86,61.15 36.86,80.18 38.52,81.83 38.52,83.62 38.95,84.05 38.95,84.64 38.07,85.51 38.02,85.51 v37.81,85.73
D1  (via drill 0.33)
  Top 0.254: v38.75,85.78 38.75,85.48 39.41,84.83 39.41,83.88 39.1,83.57 U1.28
  Bottom 0.254: P1.23 44.62,54.81 37.32,62.11 37.32,79.99 38.98,81.64 38.98,83.18 39.41,83.61 39.41,84.86 38.75,85.51 v38.75,85.78
D2  (via drill 0.33)
  Top 0.254: U1.29 39.6,83.42 39.87,83.69 39.87,85.01 39.63,85.25 v39.63,85.59
  Bottom 0.254: P1.24 37.78,63.24 37.78,79.8 39.43,81.45 39.43,82.99 39.87,83.42 39.87,85.05 39.63,85.29 v39.63,85.59
D3  (via drill 0.33)
  Top 0.254: U1.30 40.1,83.28 40.32,83.5 40.32,85.4 v40.52,85.59
  Bottom 0.254: P1.25 47.62,54.81 38.24,64.19 38.24,79.61 39.89,81.27 39.89,82.8 40.32,83.23 40.32,85.4 v40.52,85.59
D4  (via drill 0.33)
  Top 0.254: v41,84.81 40.78,84.6 40.78,83.31 40.6,83.13 U1.31
  Bottom 0.254: P1.26 38.69,65.32 38.69,79.42 40.78,81.51 40.78,84.6 v41,84.81
D5  (via drill 0.33)
  Top 0.254: v41.45,84.01 41.24,83.8 41.24,83.12 41.1,82.98 U1.32
  Bottom 0.254: P1.27 50.62,54.81 39.15,66.28 39.15,79.23 41.24,81.32 41.24,83.8 v41.45,84.01
D6  (via drill 0.33)
  Top 0.254: v41.6,85.47 41.6,85.16 42.13,84.63 42.13,83.73 41.72,83.33 41.72,82.97 41.62,82.86 41.62,81.87 U1.33
  Bottom 0.254: P1.28 39.61,67.41 39.61,79.04 41.69,81.13 41.69,83.3 42.13,83.73 42.13,84.62 41.6,85.15 v41.6,85.47
D7  (via drill 0.33)
  Top 0.254: v42.47,83.12 42.41,83.07 | 42.41,83.07 42.39,83.07 42.39,82.99 42.12,82.71 42.12,81.87 U1.34 42.1,82.16 42.12,82.18 42.12,82.42 | 42.41,83.07 42.42,83.07
  Bottom 0.254: P1.29 53.62,54.81 40.06,68.36 40.06,78.85 42.15,80.94 42.15,82.81 v42.47,83.12
DCK
  Top 0.254: U1.94 29.6,104.85 P2.36
ELP2
  Top 0.254: P3.OUT 66.37,90.67 FB1.4
ELP3
  Top 0.254: P3.IN 65.25,89.8 FB1.3
ELP4
  Top 0.254: FB1.2 64.13,89 64.5,88.64 66.51,88.64 P3.SD
ELP5
  Top 0.254: P3.CLK 65.43,87.58 64.88,88.12 FB1.1
EM10_GND
  Top 0.254: 51.31,2 48.06,2 45.56,4.5 40.31,4.5 | 39.06,5.81 39.06,5.5
  pour Top (isolate 0.25): 36.56,7.75 36.56,5.4 38.81,3.15 38.81,0 43.81,0 43.81,0.25 59.81,0.25 59.81,3.3 54.61,3.3 54.46,3.15 48.41,3.15 46.41,5.15 40.41,5.15 38.31,7.25 38.31,7.75
  pour Top (isolate 0.25, rank 5): 57.56,9.62 60.31,9.62 60.31,0.25 57.56,0.25
EM10_POS  (via drill 0.35)
  other vias: 60.81,2.9 62.31,2.9 62.31,0.9 60.81,0.9 61.57,1.82
  pour Bottom (isolate 0.254): 40.81,11.29 40.81,9 45.31,9 45.31,0.25 62.61,0.25 62.61,3.18 49.84,3.18 47.03,5.99 47.03,11.29
  pour Top (isolate 0.25, rank 4): 60.53,9.59 60.53,-0.25 62.59,-0.25 62.59,9.59
GND  (via drill 0.33, 0.35)
  Top 0.254: C48.2 48.41,71.11 46.8,71.11 45.76,72.15 45.76,73.53 | 45.76,73.53 U3.2 | 45.76,73.53 45.74,73.55 45.74,74.68 45.55,74.88 44.97,74.88 44.78,74.68 44.78,73.84 U3.4 44.76,72.25 v44.58,72.25 | U6.3 49.53,77.33 | 49.53,77.33 49.53,76.45 C16.2 | C45.2 47.89,86.1 U1.44 | C41.2 34.6,79.32 U1.19 34.6,83.56 34.88,83.85 34.88,85.74 35.37,86.22 | U2.21 15.83,95.86 v15.68,96 | v14.13,80.29 13.56,79.73 C33.2 | U7.2 v53.57,101.34 | U1.108 22.79,93.6 v22.57,93.81 | Q2.E 56.44,99.32 v55.29,99.32 | C3.2 58.99,105.66 | 58.91,104.51 v58.91,104.55 | R8.1 51.84,104.52 | SW1.P$MP2 65.44,112.68 65.44,114.28 68.58,114.28 v68.86,114 | P2.33 31.11,108.45 31.56,108.45 | C24.2 28.13,100.35 28.07,100.35 | U1.59 47.83,93.6 | 47.83,93.6 47.93,93.6 47.93,93.61 | U1.58 47.83,93.1 | 47.83,93.1 47.83,93.6 | 47.83,91.6 U1.55 44.26,91.6 | 47.83,91.6 47.83,93.1 | 47.83,91.6 47.83,91.1 U1.54 44.26,91.1 44.26,91.6 | 44.26,91.6 43.62,91.6 43.62,91.94 | 47.43,88.77 47.43,89.1 U1.50 44.26,89.1 44.26,89.6 U1.51 46.9,89.6 47.28,89.22 v47.43,89.22 | 44.26,88.77 44.26,88.6 U1.49 47.43,88.6 v47.43,87.97 47.89,87.97 | 49.53,77.33 v49.03,77.33 v49.03,77.34 | C17.2 46.25,77.84 v46.37,77.84 | C49.2 43.27,70.28 v43.27,70.71 | C1.2 56.32,85.71 54.78,85.71 | C9.2 63.27,94.29 | C40.2 18.15,73.25 18.22,73.33 | U4.2 18.22,73.33 | 18.22,73.33 18.22,73.25 v18.29,73.31 | C39.2 19.07,77.17 U4.4 18.26,77.07 v18.22,77.1 | 44.53,101.37 45.11,101.95 P2.5 45.11,108.03 45.53,108.45 | P2.50 22.61,106.3 22.81,106.5 | U1.84 34.62,97.87 34.62,99.26 34.81,99.46 34.81,101.76 | C29.2 34.81,101.76 | 34.81,101.76 34.81,102.6 v34.51,102.9 | VR1.P$1 57.31,78.89 56.57,78.89 v55.39,80.06
  Top 0.4: C45.2 47.89,87.97
  Bottom 0.254: v15.68,96 13.78,94.09 13.78,80.64 v14.13,80.29 | v68.86,114 68.86,114.17 69.02,114.17 | 28.07,100.35 28.07,100.19 28.38,100.19 | 42.81,12 43.1,12.29 SELECT.P$1 | 62.58,42.27 62.81,42.5 | 52.82,42.77 52.34,43.25 | 55.76,34.39 55.97,34.19 | 44.42,34.39 44.4,34.38 | v42.6,6.22 42.42,6.4 42.42,7.1 41.81,7.71 | 41.81,7.75 41.81,7.71 | 41.81,7.71 41.73,7.79 40.02,7.79 39.81,8 | 4.62,44.06 4.81,44.25 | v28.64,10.94 29.45,11.75 31.31,11.75 31.57,12.01 START.P$1 | v34.79,16.83 34.79,19.02 34.56,19.25 | P3.P$10 67.23,93.35 66.46,92.58 | 67.23,86.18 P3.P$7 | 33.42,12.71 v33.62,12.51 | A.P$2 7.37,34.63 v7.35,34.61 | B.P$1 18.29,31.82 21.31,31.82 21.31,30.85 | RIGHT.P$1 46.47,34.33 49.31,34.33 | v49.42,32.7 49.31,32.81 | DOWN.P$2 54.16,29.4 52.91,29.4 52.81,29.5 | UP.P$1 54.26,48.25 54.26,45.3 | LEFT.P$2 65.31,34.3 | P1.32 58.32,56.4 58.41,56.31 58.41,55.3 | 58.71,56.36 58.71,55.35 | 58.56,56.36 58.56,55.35 | 57.81,56.41 57.81,55.4 | 57.66,56.41 57.66,55.4 | 57.51,56.41 57.51,55.4
  Bottom 0.3: 67.23,86.18 66.46,86.95 66.46,92.58
  Bottom 0.504: 49.31,34.33 49.31,32.81 | 54.26,45.3 52.81,45.3
  Bottom 0.508: 65.31,34.3 65.31,33 | 52.86,29.4 54.16,29.4 | 54.56,33.1 54.56,34.4 | 54.61,34.65 53.31,34.65 | 54.56,42.2 54.56,40.9
  other vias: 52.22,105.63 53.28,85.86 62.42,94.96 29.28,0.97 27.85,3.85 29.32,5.57 24.87,6.37 22.83,9.79 24.58,9.79 31.72,4.29 34.26,5.48 36.95,3.49 59.78,24.65 43.67,38.6 59.32,50.31 36.49,9.4 24.92,12.48 23.89,13.43 23.28,19.75 25.75,22.45 12.27,22.65 12.27,25.82 12.27,28.36 9.73,32.17 13.54,34.08 15.38,29.97 22.96,29.97 18.7,29.97 14.43,37.47 16.33,36.41 12.21,38.64 17.75,40.31 20.04,40.24 20.04,44.16 20.04,47.09 15.84,47.09 11.72,46.43 13.82,42.35 7.45,50.25 4.53,48.6 4.57,55.59 4.57,51.78 2.67,46.7 8.41,43.94 2.67,40.98 2.67,34.63 6.25,28.92 9.18,25.74 34.1,51.38 38.67,51.38 46.2,51.35 52.17,51.35 0.76,55.59 0.76,57.97 0.76,61.94 2.83,57.97 5.68,59.24 0.76,65.98 8.86,62.41 12.03,65.59 15.84,69.4 0.76,71.06 0.76,76.14 0.76,81.22 0.76,85.55 0.76,93.13 0.76,96.46 0.76,102.54 0.76,114.01 12.67,70.03 8.86,73.84 6.95,78.29 7.2,82.87 6.81,86.04 5.15,88.4 5.15,90.3 5.15,93.32 2.75,98.45 2.98,103.05 8.94,111.55 14.1,112.1 14.1,114.01 5.21,114.01 9.65,114.01 8.86,108.21 10.84,110.36 14.02,110.36 12.11,106.55 11.48,104 9.57,105.91 15.29,106.55 14.65,102.73 17.19,105.28 14.65,104.64 7.43,105.43 7.72,98.7 9.97,100.71 8.02,96.11 10.84,98.69 12.43,100.27 11.72,101.7 9.57,103.37 22.03,79 24.57,79 24.1,77.89 13.09,80.29 13.53,77.75 14.32,76.95 5.84,71.06 5.84,65.98 8.38,68.52 38.86,47.57 43.94,47.57 48.39,47.57 51.86,46.05 52.6,44.75 55.49,40.67 57.65,52.38 52.04,63.21 53.94,61.3 55.85,59.4 55.85,63.21 59.66,63.21 62.39,87.02 59.66,58.63 59.66,54.76 51.85,43.39 41.38,44.64 47.28,95.83 55,95.73 53.36,95.73 50.42,95.73 47.48,91.38 48.83,94.92 62.42,93.21 44.26,89.64 44.26,88.53 44.26,90.75 44.26,91.86 26.4,93.29 30.21,93.29 34.02,93.29 37.83,93.29 41.64,93.29 26.4,89.48 26.4,85.67 30.21,89.48 34.02,89.48 37.83,89.48 41.64,89.48 34.97,84.88 42.91,85.67 43.62,83.29 39.34,86.62 32.35,86.86 28.31,85.75 26.32,83.21 34.1,85.99 36,85.99 24.81,98.61 22.19,99.08 20.53,99.64 17.91,99.32 20.05,101.54 26.88,101.54 23.86,101.54 31.08,107.26 27.27,107.26 23.46,107.26 34.89,107.26 38.7,107.26 42.51,107.26 46.32,107.26 48.13,106.16 45.53,102.93 21.8,105.67 19.26,105.67 17.99,109.48 16.1,113.15 42.99,99.32 44.89,97.5 47.83,97.5 47.6,99.81 49.01,104.33 56.44,107.53 56.03,112.4 55.13,113.34 52.41,110.32 53.44,106.96 51.17,110.36 49.66,113.37 44.58,113.37 39.5,113.37 34.42,113.37 29.34,113.37 24.26,113.37 19.18,113.37 44.53,101.23 57.59,114.01 59.29,112.4 61.64,112.4 60.77,114.01 67.38,113.01 57.3,104.48 57.66,60.67 16.33,33.01 0.76,112.1 5.21,112.1 68.86,112.09 47.48,93.38 55.28,85.86 54.78,90.36 50.28,90.36 35.82,13.26 61.2,43.5 61.93,48.3 61.92,79.29 61.92,67.29 61.92,64.29 61.91,60.67 34.61,47.57 37.63,44.64 50.96,44.79 46.21,44.64 41.38,40.89 61.9,32.55 61.9,26.55 61.74,22.05 52.58,32.66 52.33,26.82 35.88,1.27 57.3,22.05 52.49,22.05 47.39,16.6 68.74,7.3 68.74,1.3 63.49,1.3 65.99,1.3 65.99,4.3 68.74,4.3 47.98,9.6 51.89,9.35 52.32,12.91 53.54,12.91 53.64,6.6 56.79,10.07 56.79,7.57 44.5,5.97 34.82,14.76 24.93,20.68 47.98,7.85 51.67,30.45 47.39,14.6 27.45,24.36 28.42,23.4 29.17,22.65 30.39,21.43 61.92,81.79 39.83,7.77 38.48,9.07 61.63,46.8 46.14,16.6 46.14,14.6 9.2,48.5 61.93,52.05 61.93,56.55 56.07,50.56 62.39,85.02 62.39,83.02 54.24,34.17 54.24,39.17 59.99,34.17 56.24,39.17 58.99,38.42 59.99,35.42 57.24,34.17 61.9,29.55 46.6,41.89 51.6,41.89 54.78,24.65 7.76,102.54 37.32,11.76 23.89,16.93
  pour Top (isolate 0.254, rank 6): -10.99,120.52 80.45,120.52 80.45,-3.31 -10.99,-3.31
  pour Bottom (isolate 0.254, rank 6): -10.99,120.52 80.45,120.52 80.45,-3.31 -10.99,-3.31
  pour Top (isolate 0.254, rank 2): 17.59,79.88 17.59,76.06 20.13,76.06 21.4,77.33 23.94,77.33 25.84,79.24 19.34,79.24 18.7,79.88
HP_SWITCH  (via drill 0.33)
  Top 0.254: U3.3 45.26,70.81 v45.28,70.79 | v56.43,58.56 56.13,58.56 56.1,58.58 55.49,58.58 55.12,58.21 4.18,58.21 2.41,56.44 2.41,49.82 0.51,47.91 0.51,33.68 4,30.19 4,21.25 4.43,20.82 19.64,20.82 20.13,20.33 20.13,8.08 v20.85,7.36 | 32.71,6.13 EM4.1 | v28.52,7.24 28.79,7.24 29.68,6.34 32.49,6.34 EM4.1 | EM4.1 34.41,7.33 C51.1 37.44,9.28 R36.1
  Bottom 0.254: v45.28,70.79 45.33,70.74 45.33,69.7 46.9,68.12 46.9,67.12 55.44,58.58 56.1,58.58 56.13,58.56 v56.43,58.56 | v28.52,7.24 20.98,7.24 v20.85,7.36
LDB1
  Top 0.254: U1.87 33.12,97.87 33.08,97.91 33.08,99.3 33.04,99.34 33.04,102.44 34.11,103.51 P2.27
LDB2
  Top 0.254: P2.28 33.61,103.66 32.58,102.62 32.58,97.87 U1.88
LDB3
  Top 0.254: P2.29 33.09,104.84 33.09,103.78 32.08,102.77 32.08,97.87 U1.89
LDB4
  Top 0.254: P2.30 32.59,104.84 32.59,103.93 31.58,102.91 31.58,97.87 U1.90
LDB5
  Top 0.254: P2.31 32.09,104.84 32.09,104.08 31.08,103.06 31.08,97.87 U1.91
LDG1
  Top 0.254: U1.79 37.1,98.53 P2.21
LDG2
  Top 0.254: 36.62,98.31 36.6,98.29 U1.80 36.6,98.67 36.64,98.72 36.64,104.11 36.61,104.14 P2.22
LDG3
  Top 0.254: U1.81 36.1,98.79 36.18,98.88 36.18,99.5 | 36.18,99.5 36.18,99.53 | 36.18,99.5 36.18,103.97 36.11,104.04 P2.23
LDG4
  Top 0.254: U1.82 35.6,98.95 35.72,99.08 35.72,103.78 35.61,103.89 P2.24
LDG5
  Top 0.254: U1.83 35.1,99.1 35.27,99.27 35.27,103.59 35.13,103.73 35.13,104.84 P2.25
LDR1
  Top 0.254: U1.73 40.1,104.85 P2.15
LDR2
  Top 0.254: P2.16 39.61,97.87 U1.74
LDR3
  Top 0.254: U1.75 39.1,104.85 P2.17
LDR4
  Top 0.254: P2.18 38.61,97.87 U1.76
LDR5
  Top 0.254: U1.77 38.1,104.85 P2.19
LIN_AMP
  Top 0.254: R30.1 51.88,75.98 50.53,74.63 48.83,74.63 R31.2 47.31,74.38 46.75,73.82 U3.1
LP
  Top 0.254: P2.35 30.11,97.87 U1.93
MA0  (via drill 0.33)
  Top 0.254: U2.17 18.03,95.56 18.55,96.08 19.6,96.08 20.1,95.58 v20.76,95.58 | v26.58,95.78 27.1,96.3 U1.99
  Bottom 0.254: v20.76,95.58 23.94,95.58 24.16,95.36 26.16,95.36 v26.58,95.78
MA1  (via drill 0.33)
  Top 0.254: U2.16 18.58,95.35 18.86,95.62 19.41,95.62 v20.13,94.91 | v27.42,95.5 27.6,95.67 U1.98
  Bottom 0.254: v27.42,95.5 26.83,94.91 23.97,94.91 23.76,95.11 21.25,95.11 21.04,94.91 v20.13,94.91
MA2  (via drill 0.33)
  Top 0.254: U2.15 19.53,94.23 v20.79,94.23 | v28.38,95.88 28.1,96.17 U1.97
  Bottom 0.254: v20.79,94.23 21.05,94.23 21.43,94.61 23.61,94.61 23.78,94.45 27.46,94.45 28.38,95.37 v28.38,95.88
MA3
  Top 0.254: U2.14 19.13,83.96 20.78,85.6 U1.124
MA4
  Top 0.254: U1.123 20.63,86.1 18.58,84.06 U2.13
MA5
  Top 0.254: U2.12 18.03,84.15 20.48,86.6 U1.122
MA6
  Top 0.254: U1.121 23.83,87.08 20.32,87.08 17.48,84.25 U2.11
MA7
  Top 0.254: U2.10 16.93,84.34 20.19,87.6 U1.120
MA8
  Top 0.254: U2.4 13.63,84.28 19.46,90.1 U1.115
MA9
  Top 0.254: U1.114 19.31,90.6 13.08,84.37 U2.3
MA10
  Top 0.254: U1.111 18.22,92.1 12.86,92.1 11.98,92.97 U2.28
MA11
  Top 0.254: U2.2 12.53,84.47 19.16,91.1 U1.113
MA12
  Top 0.254: U1.119 20.04,88.1 16.38,84.44 U2.9
MD0  (via drill 0.33)
  Top 0.254: U2.18 17.48,95.66 18.37,96.54 20.1,96.54 v20.28,96.35 | v25.69,96.04 25.88,96.04 26.6,96.75 U1.100
  Bottom 0.254: v20.28,96.35 20.38,96.25 24.22,96.25 24.65,95.82 25.47,95.82 v25.69,96.04
MD1  (via drill 0.33)
  Top 0.254: v20.97,96.92 20.66,96.92 20.56,97.03 18.21,97.03 16.93,95.75 U2.19 | v24.98,96.71 25.23,96.71 25.32,96.8 25.88,96.8 26.1,97.01 U1.101
  Bottom 0.254: v20.97,96.92 21.05,96.84 24.85,96.84 v24.98,96.71
MD2  (via drill 0.33)
  Top 0.254: U2.20 16.38,95.85 18.02,97.48 20.27,97.48 v20.48,97.7 | v24.75,97.61 24.99,97.85 U1.102
  Bottom 0.254: v20.48,97.7 20.58,97.6 21.24,97.6 21.35,97.5 24.63,97.5 v24.75,97.61
MD3  (via drill 0.33)
  Top 0.254: U2.22 15.28,95.45 15.01,95.72 15.01,96.28 16.43,97.7 v17.28,97.7 | U1.103 22.95,96.1 22.55,96.5 22.55,97.66 | 22.55,97.66 22.55,97.87 | v22.56,98.18 22.56,97.66 22.55,97.66
  Bottom 0.254: v17.28,97.7 17.41,97.83 19.66,97.83 20.2,98.37 20.76,98.37 20.96,98.18 v22.56,98.18
MD4  (via drill 0.33)
  Top 0.254: U2.23 14.73,95.36 14.55,95.54 14.55,96.47 16.51,98.43 v16.71,98.43 | U1.104 22.63,95.6 22.1,96.13 22.1,97.68 21.24,98.54 v21.24,98.85
  Bottom 0.254: v16.71,98.43 16.9,98.43 16.99,98.52 19.58,98.52 19.89,98.83 21.22,98.83 v21.24,98.85
MD5
  Top 0.254: U2.24 14.18,95.26 14.1,95.35 14.1,96.82 16.38,99.1 16.95,99.1 16.99,99.1 18.15,97.94 19.77,97.94 20.2,98.37 20.76,98.37 21.64,97.49 21.64,95.76 22.29,95.11 23.83,95.11 U1.105
MD6
  Top 0.254: U2.25 13.63,93.71 13.78,93.56 21.07,93.56 22.09,94.58 23.83,94.58 U1.106
MD7
  Top 0.254: U1.109 13.4,93.1 13.08,93.42 U2.26
N$1
  Top 0.254: FB1.5 61.45,90.67 | 61.45,90.67 RA3.4 | C7.1 61.45,92.47 61.45,90.67
N$2
  Top 0.254: FB1.6 RA3.3 60.74,89.78 60.26,89.78 60.03,90.02 60.03,91.69 C6.1
N$3
  Top 0.254: Q2.C 58.95,100.93 R10.1 60.18,102.01 61.83,103.67 R9.2
N$4
  Top 0.254: R30.2 C52.2
N$5
  Top 0.254: C53.2 R32.2
N$6
  Top 0.254: FB1.7 RA3.2 60.74,89.02 60.26,89.02 59.99,88.75 59.99,87.43 59.25,86.69 C5.1
N$7
  Top 0.254: C52.1 54.27,76.06 55.05,76.06 55.71,75.41 VR1.P$3
N$8
  Top 0.254: R27.1 28.1,78.23 U1.6
N$9
  Top 0.254: FB1.8 61.41,88.12 | 61.41,88.12 RA3.1 | 61.41,88.12 61.41,86.94 C4.1
N$10
  Top 0.254: C53.1 54.13,79.79 56.54,77.38 VR1.P$2
N$11  (via drill 0.35)
  Top 0.254: SW1.P$3 61.84,109.16 | 62.19,105.48 R1.1
  Top 0.508: SW1.P$3 62.29,108.61 v61.43,107.75 | v61.41,104.69 62.19,105.48
  Bottom 0.254: v61.43,107.75 61.93,107.25 61.93,105.22 v61.41,104.69
N$12
  Top 0.254: R9.1 62.6,101.53 62.6,100.19 63.71,99.07 65.48,99.07 66.59,100.17 LED1.K
N$13
  pour Top (isolate 0.25, rank 5): 52.06,16.72 52.06,13.91 60,13.91 60,16.72
N$14
  Top 0.254: 52.08,102.29 U7.3 52.81,102.29 52.81,103.11 54.46,104.76 | C3.1 55.36,105.66 | 55.36,105.66 R4.1 | 54.46,104.76 55.36,105.66 | 54.46,104.76 54.56,104.76 55.95,103.37 R2.2
N$15  (via drill 0.33, 0.35)
  Top 0.457: 54.31,108.9 53.93,109.28 SW1.P$1 | 55.76,108.9 v55.96,108.7 v55.96,109.6
  Bottom 0.457: v55.96,108.7 57.31,110.05 63.71,110.05 63.71,103.1 64.11,102.7 68.85,102.7
  other vias: 66.81,79.6 65.31,80.56 66.31,80.56 65.81,79.6 65.31,78.56 66.31,78.56 55.96,110.55
  pour Top: 54.18,109.62 55.36,110.8 56.26,110.8 56.26,108.42 55.39,108.42
  pour Bottom: 55.41,111.5 55.41,108.4 62.46,108.4 62.46,100.97 69.41,100.97 69.41,103.1 64.06,103.1 64.06,111.5
  pour Top (isolate 0.254, rank 3): 64.71,8.26 70.06,8.26 70.06,80.82 64.71,80.82
  pour Top (isolate 0.25, rank 5): 62.31,15.25 68.06,15.25 68.06,8.5 67.81,8.25 62.31,8.25
  pour Bottom: 65.16,78.35 67.31,78.35 67.31,80.8 65.81,80.8 65.81,95.75 67.31,95.75 67.31,98 69.81,98 69.81,103.1 64.36,103.1 64.36,94.55 63.41,93.6 63.41,80.1
N$16
  pour Top (isolate 0.25, rank 4): 60.56,17.91 60.56,15.28 65.31,15.28 65.31,17.91
N$17
  pour Top (isolate 0.25, rank 3): 59.93,14.78 59.93,10.12 61.9,10.12 61.9,14.78
N$18  (via drill 0.33)
  Top 0.254: RA3.6 58.65,89.8 57.64,88.79 57.64,85.57 56.71,84.64 54.3,84.64 53.98,84.32 v53.98,83.78 | v44.32,84.7 44.42,84.6 U1.41
  Bottom 0.254: v44.32,84.7 44.51,84.51 48.68,84.51 50.1,83.08 53.28,83.08 v53.98,83.78
N$20
  pour Top (isolate 0.25, rank 4): 54.31,13.41 59.43,13.41 59.43,10.88 54.31,10.88
N$23
  Top 0.254: C20.1 C13.1 4.48,102.19 5.81,103.51 5.81,108 6.72,108.91 8.12,108.91 10.45,111.24 BRIGHTNESS.TP
N$24
  Top 0.254: P3.GND 67.09,87.64 67.08,87.78 65.68,86.38 64.44,86.38 64.13,86.69 EM9.1
N$25  (via drill 0.33)
  Top 0.254: v6.52,105.72 6.52,101.71 C14.1 C15.1 | v6.52,109.69 6.52,110.47 PALETTE.TP
  Bottom 0.254: v6.52,105.72 v6.52,109.69
N$26  (via drill 0.35)
  Top 0.254: R5.1 54.26,102.19 v53.56,102.89 | 50.16,104.21 51.16,103.21 v51.16,102.3 51.16,101.63 51.42,101.38 51.42,100.89 51.81,100.5 52.36,100.5 U7.1 | 50.16,104.21 R8.2 | C11.1 48.29,103.19 49.14,103.19 50.16,104.21
  Bottom 0.254: v53.56,102.89 51.75,102.89 v51.16,102.3
N$29
  Top 0.254: U3.7 44.76,68.58 44.55,68.36 42.09,68.36 C49.1
N$31  (via drill 0.33)
  Top 0.254: R2.1 58.19,102.97 56.82,101.6 | 56.82,101.6 Q2.B | R11.2 58.86,98.54 57.91,99.5 57.91,100.39 56.82,101.47 | 56.82,101.47 56.82,101.6 | U7.4 50.96,101.19 50.96,100.45 51.79,99.63 51.95,99.63 53.34,99.63 v53.4,99.56 | v55.52,101.34 55.65,101.47 56.82,101.47
  Bottom 0.254: v53.4,99.56 55.18,101.34 v55.52,101.34
N$35
  Top 0.254: EM4.2 34.99,9.62 P5.SW
N$40  (via drill 0.33)
  Top 0.254: C27.2 8.99,21.28 19.83,21.28 20.59,20.52 20.59,8.88 v21.03,8.44 | v28.52,8.37 28.52,8.62 30.29,10.39 R22.1 30.62,10.5 32.83,10.5 P5.R
  Bottom 0.254: v21.03,8.44 21.78,7.69 28.02,7.69 28.52,8.19 v28.52,8.37
N$41
  Top 0.254: 23.64,10.96 C26.2 23.68,10.92 25.62,10.92 P5.L 26.14,9.84 R23.1
N$42
  Top 0.254: C26.1 23.63,8.17 EM2.2
N$43
  Top 0.254: EM3.2 5.01,22.46 C27.1
N$44
  Top 0.254: C8.1 22.03,13.25 22.03,5.13 SPK+.TP
P00  (via drill 0.33)
  Top 0.254: U1.1 25.6,81.02 25.4,80.83 25.4,79.36 v25.83,78.93 | v15.54,48.27 15.76,48.48 50.65,48.48 53.56,45.57 53.56,42.6 v52.81,41.85
  Bottom 0.254: v25.83,78.93 26.05,78.72 26.05,77.69 25.46,77.1 25.46,75.08 7.14,56.76 7.14,51.58 11.31,47.41 14.69,47.41 v15.54,48.27 | RIGHT.P$2 52.46,40.4 52.81,40.75 v52.81,41.85
P01  (via drill 0.33)
  Top 0.254: U1.4 27.12,81.83 27.12,80.99 27.42,80.68 v27.42,79.99 | v13.78,48.76 14.41,49.4 51.05,49.4 58.67,41.78 v58.67,40.77
  Bottom 0.254: v27.42,79.99 27.42,77.12 26.83,76.53 26.83,74.51 8.51,56.19 8.51,52.2 11.28,49.43 13.11,49.43 v13.78,48.76 | LEFT.P$1 68.31,40.4 62.32,40.4 61.74,39.83 59.53,39.83 58.67,40.69 v58.67,40.77
P02  (via drill 0.33)
  Top 0.254: U1.3 26.58,81.83 26.58,80.58 v26.66,80.49 | v12.83,48.76 13.95,49.88 51.31,49.88 59.31,41.87 59.31,41.85 v60.56,40.6
  Bottom 0.254: v26.66,80.49 26.75,80.4 26.75,79.71 26.97,79.5 26.97,77.31 26.37,76.72 26.37,74.7 8.05,56.38 8.05,52.01 11.3,48.76 v12.83,48.76 | UP.P$2 60.3,40.86 v60.56,40.6
P03  (via drill 0.33)
  Top 0.254: 26.08,81.83 U1.2 26.1,80.88 25.99,80.77 25.99,80.21 26.08,80.13 v26.08,79.82 | v14.41,48.09 15.27,48.94 50.86,48.94 57.95,41.85 57.95,41.29 v57.3,40.64
  Bottom 0.254: v26.08,79.82 26.29,79.6 26.29,79.53 26.51,79.31 26.51,77.5 25.92,76.91 25.92,74.89 7.59,56.57 7.59,51.77 11.28,48.09 v14.41,48.09 | v57.3,40.64 58.57,39.37 60.31,39.37 60.91,38.77 60.91,32.9 60.28,32.28 60.28,26.38 DOWN.P$1
P10  (via drill 0.33)
  Top 0.254: U1.125 20.92,85.1 19.81,83.98 v19.81,83.68 | OSD_A.TP 10.48,106.56 12.67,104.37 v12.67,101.37
  Bottom 0.254: v12.67,101.37 12.67,101.31 13.32,100.66 13.79,100.66 15.12,99.32 15.12,97.61 17.36,95.37 17.36,91.31 20.02,88.66 20.02,83.89 v19.81,83.68 19.81,72.01 5.31,57.52 5.31,49.38 10.37,44.32 10.37,42.74 A.P$1
P11  (via drill 0.33)
  Top 0.254: U1.126 21.2,84.6 20.48,83.88 v20.48,83.05 | v12.59,39.72 12.93,39.72 14.19,38.47 16.22,38.47 v16.7,37.98 | OSD_B.TP 13.65,101.39 v13.6,101.33
  Bottom 0.254: v12.59,39.72 12.59,39.84 11.84,40.59 11.84,43.51 5.77,49.59 5.77,57.33 20.26,71.82 20.26,82.83 v20.48,83.05 20.48,88.84 17.82,91.5 17.82,95.56 15.58,97.8 15.58,99.56 13.81,101.33 v13.6,101.33 | B.P$2 16.89,37.79 v16.7,37.98
P12  (via drill 0.33, 0.35)
  Top 0.254: U1.128 22.34,83.6 v22.17,83.43 | v12.99,41.87 13.49,41.37 13.49,40.55 14.66,39.38 22.93,39.38 24.31,38 24.31,29.66 25.06,28.91 v25.06,28.84 | v11.34,102.68 7.3,106.72 OSD_SEL.TP
  Bottom 0.15: SELECT.P$2 37.56,17.49 | 38.06,17.88 38.06,19.38
  Bottom 0.254: v12.99,41.87 12.79,42.07 12.79,43.9 6.68,50.01 6.68,56.95 21.18,71.44 21.18,82.15 21.74,82.71 21.74,83 v22.17,83.43 21.95,83.64 21.95,83.96 20.94,84.98 20.94,89.18 18.28,91.84 18.28,95.75 16.04,97.99 16.04,99.84 13.2,102.68 v11.34,102.68 | v25.06,28.84 25.06,25.52 29.88,20.7 36.74,20.7 38.06,19.38 | 37.56,17.5 37.56,17.49 37.67,17.49 38.06,17.88
P13  (via drill 0.33, 0.35)
  Top 0.254: U1.127 21.47,84.1 21.17,83.8 v21.28,83.69 | v12.79,40.87 12.79,40.53 14.4,38.92 22.73,38.92 23.84,37.81 23.84,29.16 v24.15,28.84
  Bottom 0.15: 26.56,19.46 26.56,17.5 | 26.04,17.5 START.P$2
  Bottom 0.254: v21.28,83.69 21.28,82.9 20.72,82.34 20.72,71.63 6.22,57.14 6.22,49.78 12.3,43.7 12.3,41.36 v12.79,40.87 | v24.15,28.84 24.15,28.75 24.59,28.31 24.59,25.33 26.92,23 26.92,19.82 26.9,19.8 26.83,19.73 26.56,19.46 | 26.56,17.5 26.04,17.5
PUSH  (via drill 0.33)
  Top 0.254: RST.2 21.27,77.21 20.13,76.06 13.7,76.06 11.5,78.26 11.5,84.83 12.87,86.2 v12.87,89.4 | SW2.T 8.74,89.4 v7.19,89.4
  Bottom 0.254: v7.19,89.4 v12.87,89.4
R4  (via drill 0.33)
  Top 0.254: RA3.7 58.8,89 v58.31,88.51 | U1.96 28.62,97.83 28.62,96.99 29.27,96.33 v29.27,96.26 | v35.37,96.39 35.62,96.64 50.27,96.64 50.89,97.26 52.86,97.26 53.42,96.7 56.82,96.7 v57.12,96.4
  Bottom 0.254: v58.31,88.51 57.36,89.47 57.36,96.16 v57.12,96.4 | v29.27,96.26 35.24,96.26 v35.37,96.39
RA0
  Top 0.254: U1.116 19.6,89.6 14.18,84.18 U2.5
RA1
  Top 0.254: U2.8 15.83,84.54 19.9,88.6 U1.118
RA1-S01
  Top 0.254: C19.2 RA1A.2
RA1-S02
  Top 0.254: RA1B.2 C18.2
RD  (via drill 0.33)
  Top 0.254: v27.93,83.84 27.93,83.52 28.6,82.85 U1.7
  Bottom 0.254: P1.4 28.63,67.41 28.63,82.81 27.93,83.52 v27.93,83.84
RES  (via drill 0.33)
  Top 0.254: 42.6,80.13 42.6,78.96 R3.2 C17.1 47.55,78.57 U6.1 | 42.6,80.13 U1.35 | v42.44,80.28 42.6,80.13 | v46.41,63.61 28.28,63.61 21.85,70.04 v21.85,72.42 | v21.85,76.06 22.8,77.01 RST.1
  Top 0.508: P1.30 55.12,50.18 58.45,46.85 C47.1
  Bottom 0.254: v42.44,80.28 42.14,80.28 40.52,78.66 40.52,69.5 v46.41,63.61 P1.30 | v21.85,72.42 21.63,72.64 21.63,75.85 v21.85,76.06
RIN_AMP
  Top 0.254: R33.2 44.18,73.74 U3.5 44.28,73.84 44.28,74.83 44.78,75.33 50.39,75.33 51,75.94 51,78.91 R32.1
ROCK_DOWN
  Top 0.254: C14.2 6.65,95.38 8.88,93.15 SW2.2
ROCK_UP
  Top 0.254: C13.2 6.01,98.49 6.01,88.78 7.99,86.8 SW2.1
ROUT  (via drill 0.33)
  Top 0.254: U3.6 44.26,70.98 43.2,72.04 R33.1 42.23,71.31 v41.65,70.73 | v55.79,57.91 55.6,57.72 4.34,57.72 2.87,56.25 2.87,49.63 0.97,47.73 0.97,33.87 4.5,30.33 4.5,27.2 5.01,26.69 EM3.1
  Bottom 0.254: v41.65,70.73 44.02,68.36 46.02,68.36 46.45,67.94 46.45,66.93 55.46,57.91 v55.79,57.91
S01  (via drill 0.33)
  Top 0.254: U1.37 43.6,80.92 45.02,79.49 49.98,79.49 50.33,79.14 v50.33,77.46 | v50.36,73.02 50.36,71.75 51.16,70.95 C19.1
  Bottom 0.254: v50.33,77.46 50.48,77.31 50.48,74.65 50.2,74.36 50.2,73.17 v50.36,73.02
S02  (via drill 0.33)
  Top 0.254: C18.1 51.88,74.14 51.76,74.02 v50.87,74.02 | v50.59,79.83 50.47,79.95 45.21,79.95 44.1,81.07 U1.38
  Bottom 0.254: v50.59,79.83 50.59,78.15 51,77.75 51,74.14 v50.87,74.02
SCK  (via drill 0.33)
  Top 0.254: RA3.8 58.88,88.12 58.13,87.37 58.13,85.41 57.7,84.99 57.68,84.97 | 57.68,84.97 R26.1 57.68,84.14 | 45.86,84.11 U1.40 44.86,84.1 v44.57,83.81 | 57.68,84.97 56.9,84.19 54.88,84.19 v54.88,83.97
  Bottom 0.254: v54.88,83.97 54.88,83.73 53.75,82.61 49.93,82.61 48.53,84.01 44.77,84.01 v44.57,83.81
SOUT  (via drill 0.33)
  Top 0.254: U1.42 44.94,85.1 v44.42,85.62 | RA3.5 58.87,90.67 57.59,89.4 57.59,89.39 57.18,88.98 57.18,85.79 56.49,85.1 53.8,85.1 v53.68,84.97
  Bottom 0.254: v44.42,85.62 45.06,84.98 48.85,84.98 50.29,83.54 52.76,83.54 53.68,84.45 v53.68,84.97
SPK+  (via drill 0.33)
  Top 0.254: U3.8 45.28,69.4 45.28,68.25 45.25,68.25 v44.7,67.69 | v56.3,56.39 55.95,56.74 4.67,56.74 3.78,55.85 3.78,49.25 1.88,47.35 1.88,34.25 5.42,30.71 5.42,28.42 12.11,21.73 20.02,21.73 22.53,19.23 22.53,16.99 C8.2
  Bottom 0.254: v44.7,67.69 44.7,67.39 55.69,56.39 v56.3,56.39
SPK-  (via drill 0.33)
  Top 0.254: R31.1 47.69,71.78 v47.43,71.78 | v47.43,69.33 47.35,69.42 U3.10 46.26,68.22 v45.69,67.66 | EM2.1 21.6,2 SPK-.TP | v56.48,57.29 56.42,57.24 4.5,57.24 3.33,56.06 3.33,49.44 1.42,47.54 1.42,34.06 4.96,30.52 4.96,28.23 9.83,23.36 9.83,21.99 v9.79,21.95
  Bottom 0.254: v47.43,71.78 v47.43,69.33 | v45.69,67.66 45.69,67.03 55.52,57.21 56.4,57.21 v56.48,57.29 | v9.79,21.95 10.92,20.82 19.64,20.82 20.13,20.33 20.13,3.04 21.42,1.75 SPK-.TP
SPL
  Top 0.254: U1.71 41.1,104.85 P2.13
SPS
  Top 0.254: P2.6 44.59,104.84 44.59,102.84 42.1,100.35 U1.69
SW  (via drill 0.33, 0.35)
  Top 0.254: R4.2 54.36,106.66 57.57,106.66 58.27,107.36 58.27,109.58 SW1.P$C 58.29,111.16 58.39,111.25 55.48,114.17 15.14,114.17 v15.05,114.08 | BATT.TP 15.18,109.08 v15.05,109.08
  Top 0.457: 63.33,22.65 63.33,82.3 64.28,83.25 68.72,83.25 69.05,83.58 69.05,101.25 68.03,102.27 63.88,102.27 63.88,110.81 63.44,111.25 58.31,111.25 58.31,109.63 SW1.P$C | 57.79,108.89 SW1.P$C | 57.79,109.02 SW1.P$C
  Bottom 0.254: v15.05,114.08 v15.05,109.08 | SW.TP 59,107.56 v60.37,107.56
  other vias: 68.92,82.11 68.92,83.26 68.02,97.21 68.97,97.21 68.02,96.06 68.97,96.06 67.82,82.11 67.82,83.26 66.67,82.11 66.67,83.26
  pour Top (isolate 0.25, rank 2): 57.31,106.62 57.31,111.5 64.06,111.5 64.06,103.09 70.06,103.09 70.06,81.31 64.22,81.31 64.22,21.09 67.06,18.25 67.06,11.09 64.93,11.09 64.93,17.88 62.72,20.09 62.72,81.81 64.65,83.75 68.03,83.75 68.03,95 67.81,95 67.81,101.29 62.97,101.29 62.97,106.62
  pour Bottom (rank 2): 65.86,81.3 69.66,81.3 69.66,97.5 67.76,97.5 67.76,84.2 65.86,84.2
SW1B  (via drill 0.35)
  Top 0.254: 21.4,25.45 28.84,25.45 43.83,10.45 43.91,9.78 P4.3
  Top 0.4: 42.75,9.53 42.39,9.06 43.66,7.78 P4.3
  Top 0.508: 21.27,25.32 21.4,25.45 | 42.75,9.53 42.75,10.62
  Bottom 0.254: 16.62,28.34 v16.31,28.65
  other vias: 13.56,28.15 19.06,28.15 13.56,22.65 19.06,22.65 14.86,28.65 17.76,28.65 19.56,26.15
  pour Top (isolate 0.254): 13.14,29.07 13.14,22.24 21.11,22.25 24.03,25.17 27.84,25.17 30.77,22.24 30.77,22.24 43.5,9.52 43.5,7.74 45.53,7.74 45.53,12.54 29,29.07
  pour Top (isolate 0.25): 42.27,11 42.27,9.05 44.31,9.05 44.31,11
  pour Bottom: 13.16,29.1 13.16,22.25 19.81,22.25 19.81,29.1
VIN  (via drill 0.33)
  Top 0.254: v43.37,80.2 43.37,80.5 43.12,80.75 43.12,81.83 U1.36
  Bottom 0.254: P1.31 56.62,54.81 40.98,70.46 40.98,78.47 41.98,79.48 42.65,79.48 v43.37,80.2
VR1-S01
  Top 0.254: RA1A.1 54.38,71.22 57.84,71.22 57.84,71.4 VR1.P$5
VR1-S02
  Top 0.254: RA1B.1 54.94,74.38 55.87,73.44 VR1.P$4
WR  (via drill 0.33)
  Top 0.254: v27.96,74.8 28.13,74.97 R27.2
  Bottom 0.254: P1.3 14.62,54.81 28.18,68.36 28.18,74.58 v27.96,74.8

## Text on the board
tPlace: P3 | SW2 | 256K / SRAM | SW2 | VR1 / 10K×2 | P1 | VR1 | 32 | 2 | 4 | 6 | 8 | 10 | 12 | 14 | 16 | 18 | 20 | 22 | 24 | 26 | 28 | 30 | 1 | 3 | 5 | 7 | 9 | 11 | 13 | 15 | 17 | 19 | 21 | 23 | 25 | 27 | 29 | 31 | C10 | C47 | BT+ | BT- | EM3 | C27 | + | EM6 | + | BT+ | F1 | C8 | R22 | DC | EM7 | F2 | P5 | R36 | DC | P4 | 7 | 1 | C26 | 2 | 3 | 6 | EM8 | 2 | + | 1 | R23 | 5 | 3 | EM2 | EM4 | 2 | 3 | EM10 | 4 | U5 | C51 | D1 | 1 | 4
bPlace: UP | A | RIGHT | LEFT | B | DOWN | START | SELECT
tNames: DOWN | UP | A | B | SEL | BAT | REV A, B, C, D | 3.3V | 2023 | MouseBiteLabs | -01 | MGBC-MBL | *
tStop: v1.5
bStop: MGBC-MBL-01